# Altium schematic sheet Front_End.SchDoc: Front_End
size A3; Author: SS; SheetNumber: 2
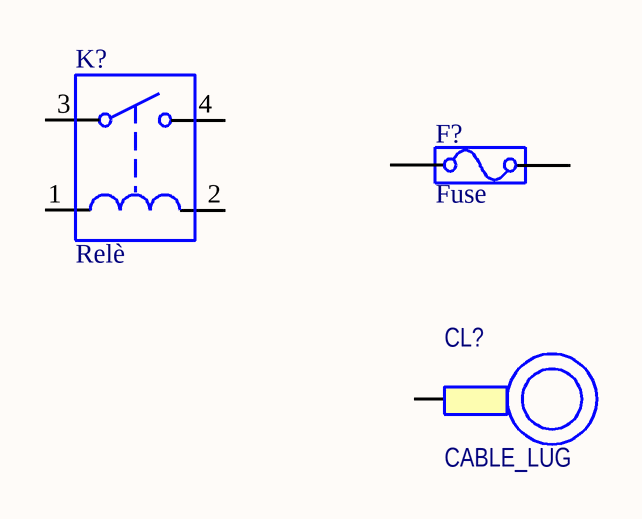
[diagram p0: Front_End.SchDoc]

## Parts
CL?  CABLE_LUG
F?  Fuse
K?  Relè

## Nets

Not connected (* = marked no-connect by the designer): CL? 1; F? 1 2; K? 1 2 3 4

## Notes on the sheet
- Size:
- (...)
- A3
- Title:
- Sheet
- of
- Author:

## Library data of the parts
CL? = CABLE_LUG: Capicorda Ring-Terminal; Value: CABLE_LUG
F? = FUSE_A: Fuse GP; Value: Fuse
K? = RELE_A: Relè GP; Value: Relè